# Altium schematic sheet ShiftAmpilfyEmit.SchDoc: Interact Lab Motherboard
size A4; DrawnBy: Ben Kazemi; DocumentNumber: 2; SheetNumber: 2; SheetTotal: 3; Number: Logic and Amplification Stage
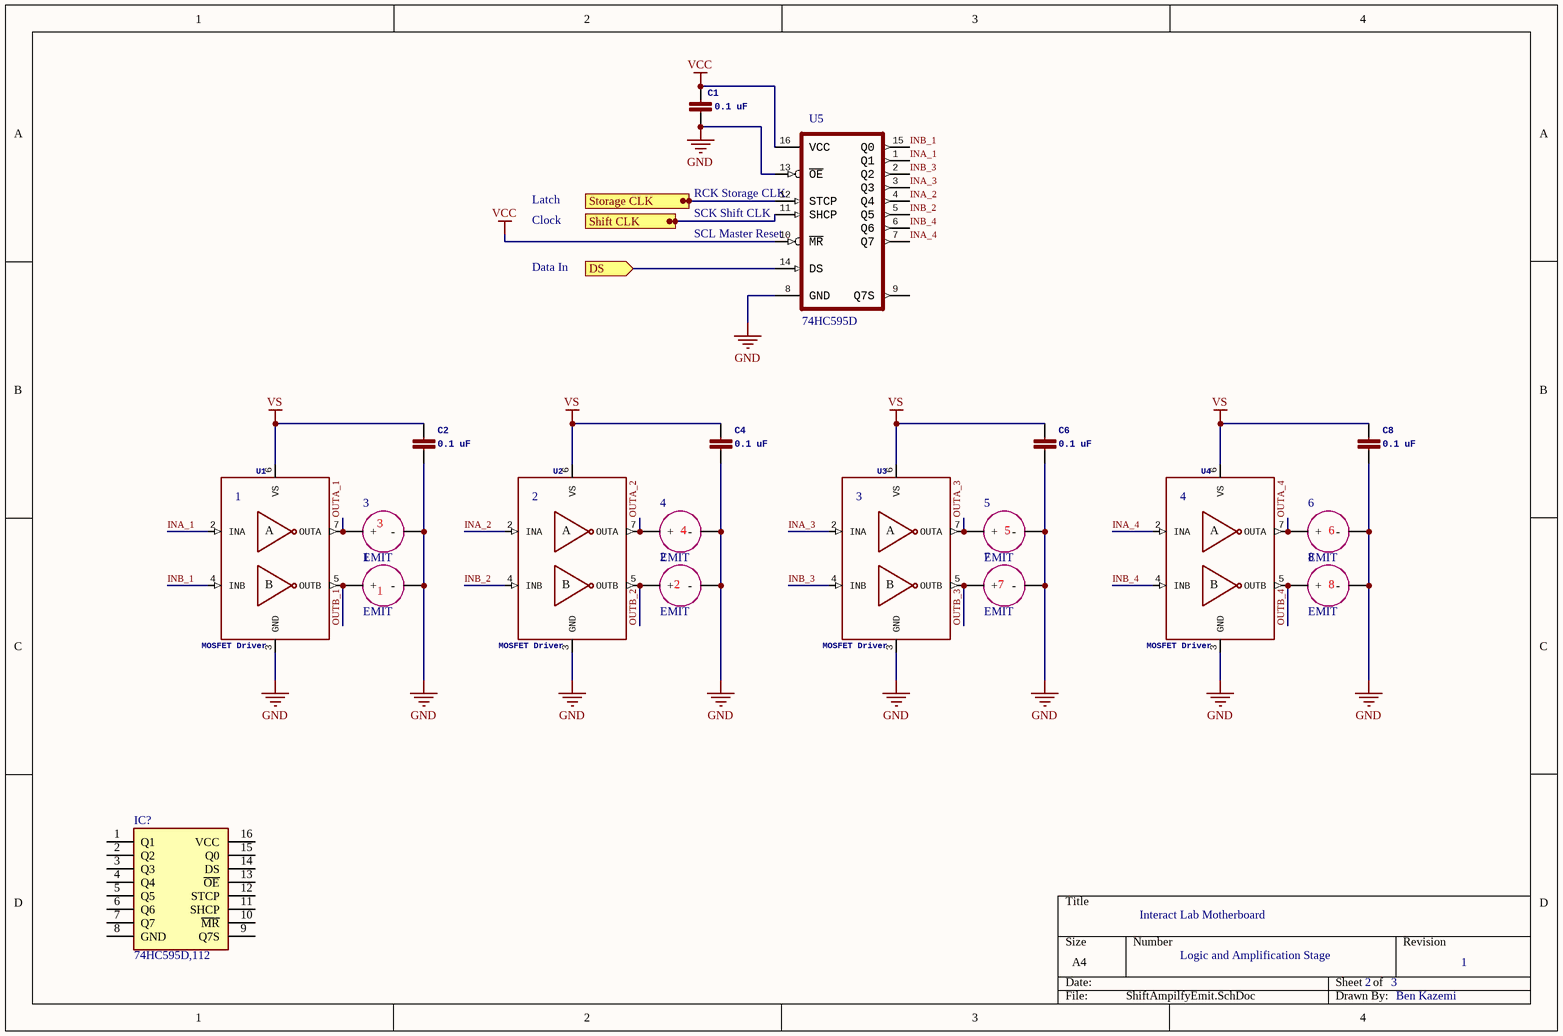
[diagram p0: ShiftAmpilfyEmit.SchDoc]

## Parts
1  EMIT  [TRANSDUCER]
2  EMIT  [TRANSDUCER]
3  EMIT  [TRANSDUCER]
4  EMIT  [TRANSDUCER]
5  EMIT  [TRANSDUCER]
6  EMIT  [TRANSDUCER]
7  EMIT  [TRANSDUCER]
8  EMIT  [TRANSDUCER]
C1  0.1 uF  [CAP0805]
C2  0.1 uF  [CAP0805]
C4  0.1 uF  [CAP0805]
C6  0.1 uF  [CAP0805]
C8  0.1 uF  [CAP0805]
IC?  74HC595D,112  [SOIC127P600X175-16N]
U1  MOSFET Driver  [MIC4127YME]
U2  MOSFET Driver  [MIC4127YME]
U3  MOSFET Driver  [MIC4127YME]
U4  MOSFET Driver  [MIC4127YME]
U5  74HC595D  [74*959D]

## Ports
DS (in), Shift CLK (in), Storage CLK (in)

## Nets
GND: 1.- 2.- 3.- 4.- 5.- 6.- 7.- 8.- C1.2 C2.2 C4.2 C6.2 C8.2 U1.3(GND) U2.3(GND) U3.3(GND) U4.3(GND) U5.8(GND) U5.13(~{OE})
VCC: C1.1 U5.10(~{MR}) U5.16(VCC)
VS: C2.1 C4.1 C6.1 C8.1 U1.6(VS) U2.6(VS) U3.6(VS) U4.6(VS)
DS: U5.14(DS) ; port DS
INA_1: U1.2(INA) U5.1(Q1)
INA_2: U2.2(INA) U5.4(Q4)
INA_3: U3.2(INA) U5.3(Q3)
INA_4: U4.2(INA) U5.7(Q7)
INB_1: U1.4(INB) U5.15(Q0)
INB_2: U2.4(INB) U5.5(Q5)
INB_3: U3.4(INB) U5.2(Q2)
INB_4: U4.4(INB) U5.6(Q6)
OUTA_1: 3.+ U1.7(OUTA)
OUTA_2: 4.+ U2.7(OUTA)
OUTA_3: 5.+ U3.7(OUTA)
OUTA_4: 6.+ U4.7(OUTA)
OUTB_1: 1.+ U1.5(OUTB)
OUTB_2: 2.+ U2.5(OUTB)
OUTB_3: 7.+ U3.5(OUTB)
OUTB_4: 8.+ U4.5(OUTB)
Shift CLK: U5.11(SHCP) ; port Shift CLK
Storage CLK: U5.12(STCP) ; port Storage CLK

Not connected (* = marked no-connect by the designer): IC? 1(Q1) 2(Q2) 3(Q3) 4(Q4) 5(Q5) 6(Q6) 7(Q7) 8(GND) 9(Q7S) 10(~{MR}) 11(SHCP) 12(STCP) 13(~{OE}) 14(DS) 15(Q0) 16(VCC); U5 9(Q7S)

## Notes on the sheet
- Latch
- Clock
- (near U5) SCL Master Reset
- (near U5) SCK Shift CLK
- (near U5) RCK Storage CLK
- Data In
- (near U1) 1
- (near U2) 2
- (near U3) 3
- (near U4) 4
- (near 3) 3
- (near 4) 4
- (near 5) 5
- (near 6) 6
- (near 1) 1
- (near 2) 2
- (near 7) 7
- (near 8) 8
- 1
- (in symbol MIC4127) A; B

## Library data of the parts
C1 C2 C4 C6 C8 = CAP CERAMIC: PROD_ID: CAP-08280
IC? = 74HC595D,112: Integrated Circuit; Manufacturer_Name: Nexperia; Datasheet Link: https://assets.nexperia.com/documents/data-sheet/74HC_HCT595.pdf; Height: 1.75mm; Manufacturer_Part_Number: 74HC595D,112; Mouser Part Number: 771-74HC595D; Mouser Price/Stock: https://www.mouser.co.uk/ProductDetail/Nexperia/74HC595D112?qs=P62ublwmbi9CWen68lvwew%3D%3D; Arrow Part Number: 74HC595D,112; Arrow Price/Stock: https://www.arrow.com/en/products/74hc595d112/nexperia?region=nac
U1-U4 = MIC4127
U5 = 74HC595D,118: Logic IC - Shift register NXP Semiconductors 74HC595D, 118 Shift register Three-state SO 16; MF: Nexperia USA; SnapEDA_Link: https://www.snapeda.com/parts/74HC595D%2C118/Nexperia%20USA%20Inc./view-part/?ref=snap; Availability: Unavailable; Price: None; MP: 74HC595D,118; Package: SO-16 Nexperia; Value: *